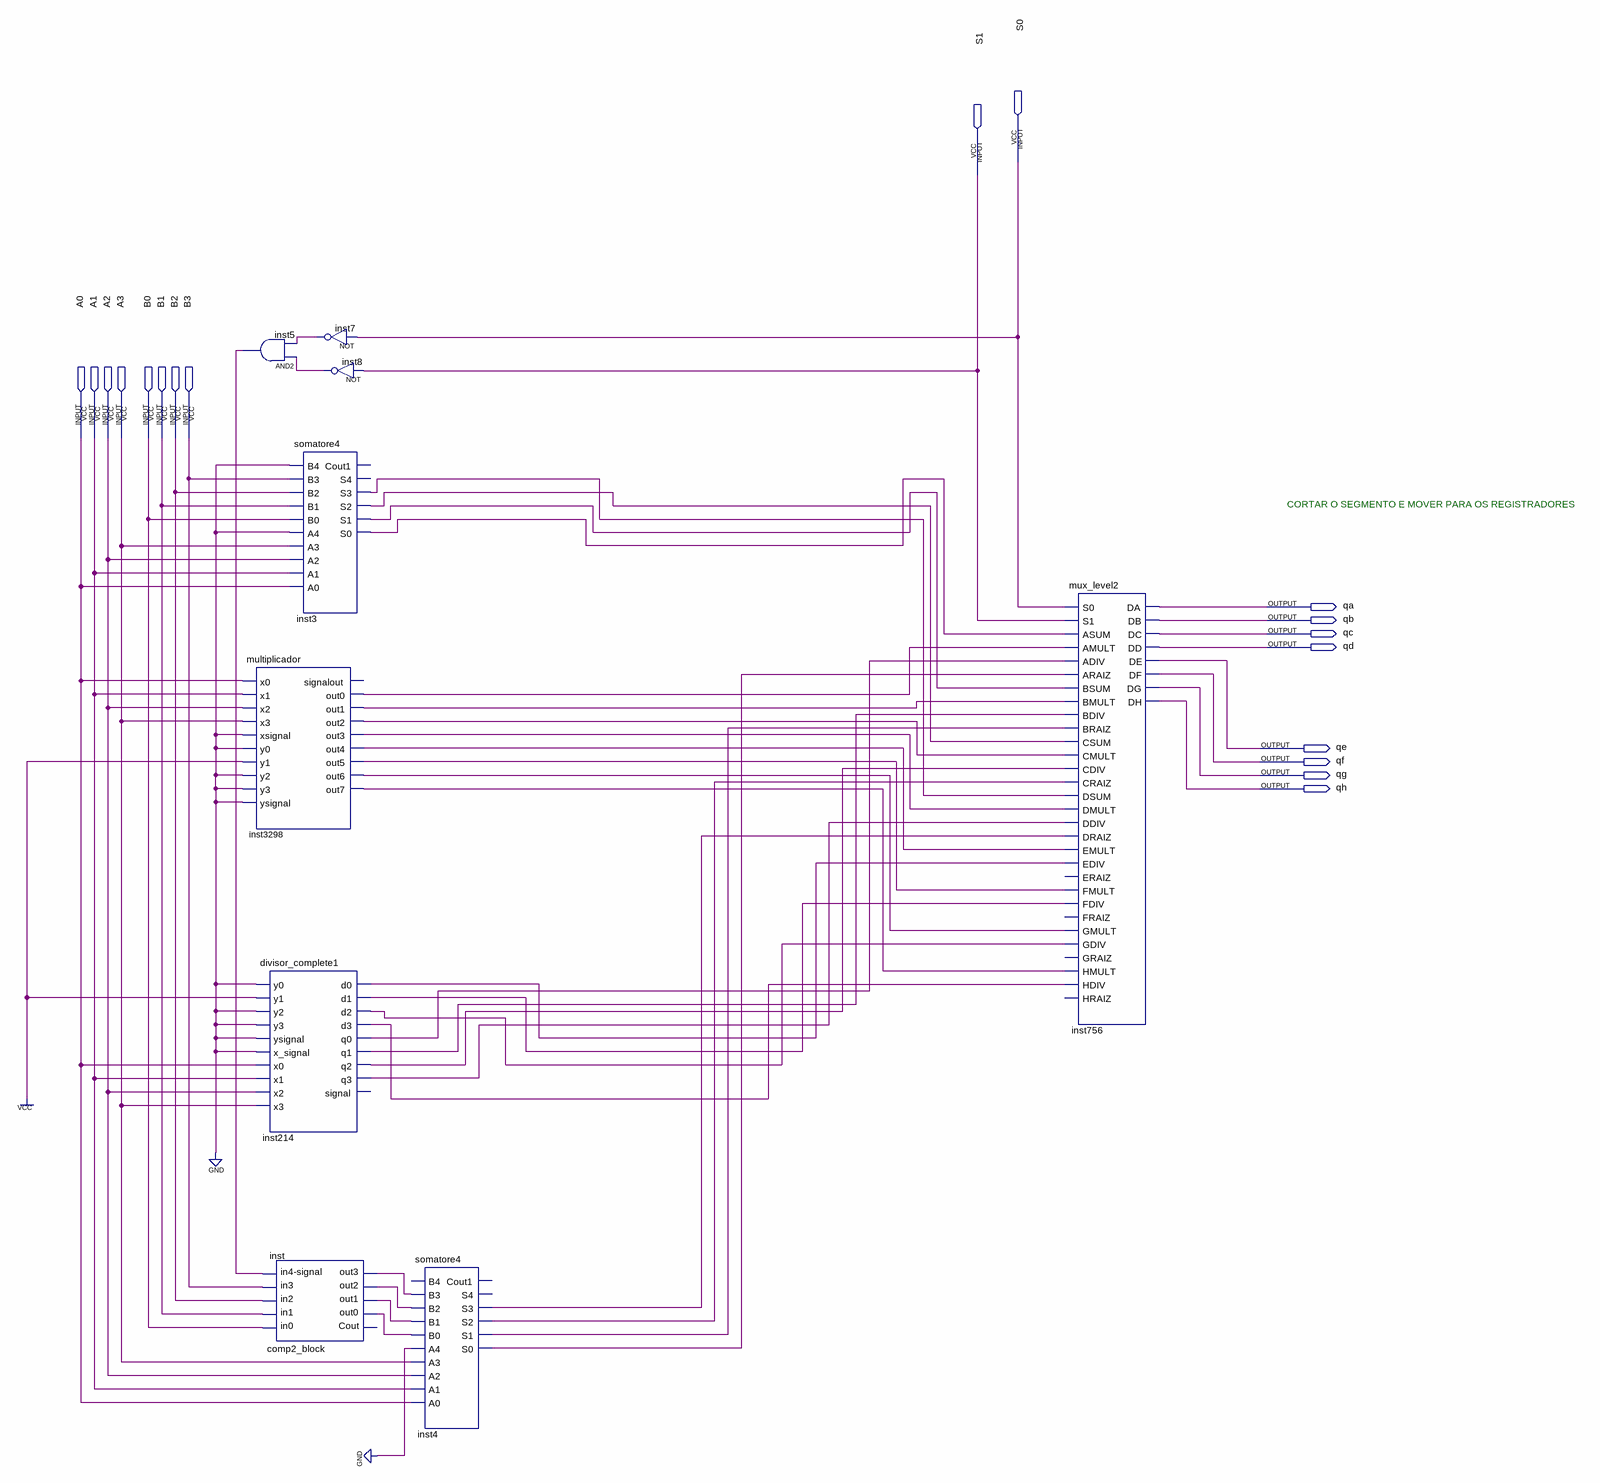
[diagram p0: schematic sheet]
// Quartus schematic end_project.bdf as structural Verilog: 9 symbols, 18 pins
module end_project (
  input  S0,
  input  S1,
  input  A0,
  input  A1,
  input  A2,
  input  A3,
  input  B0,
  input  B1,
  input  B2,
  input  B3,
  output qa,
  output qb,
  output qc,
  output qd,
  output qe,
  output qf,
  output qg,
  output qh
);

  wire inst3_s0, inst3_s1, inst3_s2, inst3_s3, inst4_s0, inst4_s1, inst4_s2, inst4_s3, inst5_out, inst7_out,
       inst8_out, inst214_d0, inst214_d1, inst214_d2, inst214_d3, inst214_q0, inst214_q1, inst214_q2,
       inst214_q3, inst3298_out0, inst3298_out1, inst3298_out2, inst3298_out3, inst3298_out4, inst3298_out5,
       inst3298_out6, inst3298_out7, inst_out0, inst_out1, inst_out2, inst_out3;

  and inst5 (inst5_out, inst8_out, inst7_out);
  multiplicador inst3298 (
    .x0(A0), .x1(A1), .x2(A2), .x3(A3), .xsignal(1'b0), .y0(1'b0), .y1(1'b1), .y2(1'b0), .y3(1'b0),
    .ysignal(1'b0), .out0(inst3298_out0), .out1(inst3298_out1), .out2(inst3298_out2), .out3(inst3298_out3),
    .out4(inst3298_out4), .out5(inst3298_out5), .out6(inst3298_out6), .out7(inst3298_out7));  // open: signalout
  divisor_complete1 inst214 (
    .y0(1'b0), .y1(1'b1), .y2(1'b0), .y3(1'b0), .ysignal(1'b0), .x_signal(1'b0), .x0(A0), .x1(A1), .x2(A2),
    .x3(A3), .d0(inst214_d0), .d1(inst214_d1), .d2(inst214_d2), .d3(inst214_d3), .q0(inst214_q0),
    .q1(inst214_q1), .q2(inst214_q2), .q3(inst214_q3));  // open: signal
  comp2_block inst (
    .in0(B0), .in1(B1), .in2(B2), .in3(B3), .\in4-signal (inst5_out), .out0(inst_out0), .out1(inst_out1),
    .out2(inst_out2), .out3(inst_out3));  // open: Cout
  not inst7 (inst7_out, S0);
  not inst8 (inst8_out, S1);
  somatore4 inst3 (
    .B4(1'b0), .B3(B3), .B2(B2), .B1(B1), .B0(B0), .A4(1'b0), .A3(A3), .A2(A2), .A1(A1), .A0(A0),
    .S3(inst3_s3), .S2(inst3_s2), .S1(inst3_s1), .S0(inst3_s0));  // open: Cout1, S4
  somatore4 inst4 (
    .B3(inst_out3), .B2(inst_out2), .B1(inst_out1), .B0(inst_out0), .A4(1'b0), .A3(A3), .A2(A2), .A1(A1),
    .A0(A0), .S3(inst4_s3), .S2(inst4_s2), .S1(inst4_s1), .S0(inst4_s0));  // open: B4, Cout1, S4
  mux_level2 inst756 (
    .S0(S0), .S1(S1), .ASUM(inst3_s0), .AMULT(inst3298_out0), .ADIV(inst214_q0), .ARAIZ(inst4_s0),
    .BSUM(inst3_s1), .BMULT(inst3298_out1), .BDIV(inst214_q1), .BRAIZ(inst4_s1), .CSUM(inst3_s2),
    .CMULT(inst3298_out2), .CDIV(inst214_q2), .CRAIZ(inst4_s2), .DSUM(inst3_s3), .DMULT(inst3298_out3),
    .DDIV(inst214_q3), .DRAIZ(inst4_s3), .EMULT(inst3298_out4), .EDIV(inst214_d0), .FMULT(inst3298_out5),
    .FDIV(inst214_d1), .GMULT(inst3298_out6), .GDIV(inst214_d2), .HMULT(inst3298_out7), .HDIV(inst214_d3),
    .DA(qa), .DB(qb), .DC(qc), .DD(qd), .DE(qe), .DF(qf), .DG(qg), .DH(qh));  // open: ERAIZ, FRAIZ, GRAIZ, HRAIZ

  // Notes on the sheet:
  //   CORTAR O SEGMENTO E MOVER PARA OS REGISTRADORES
endmodule
